# EAGLE design boot (EAGLE 6.1)
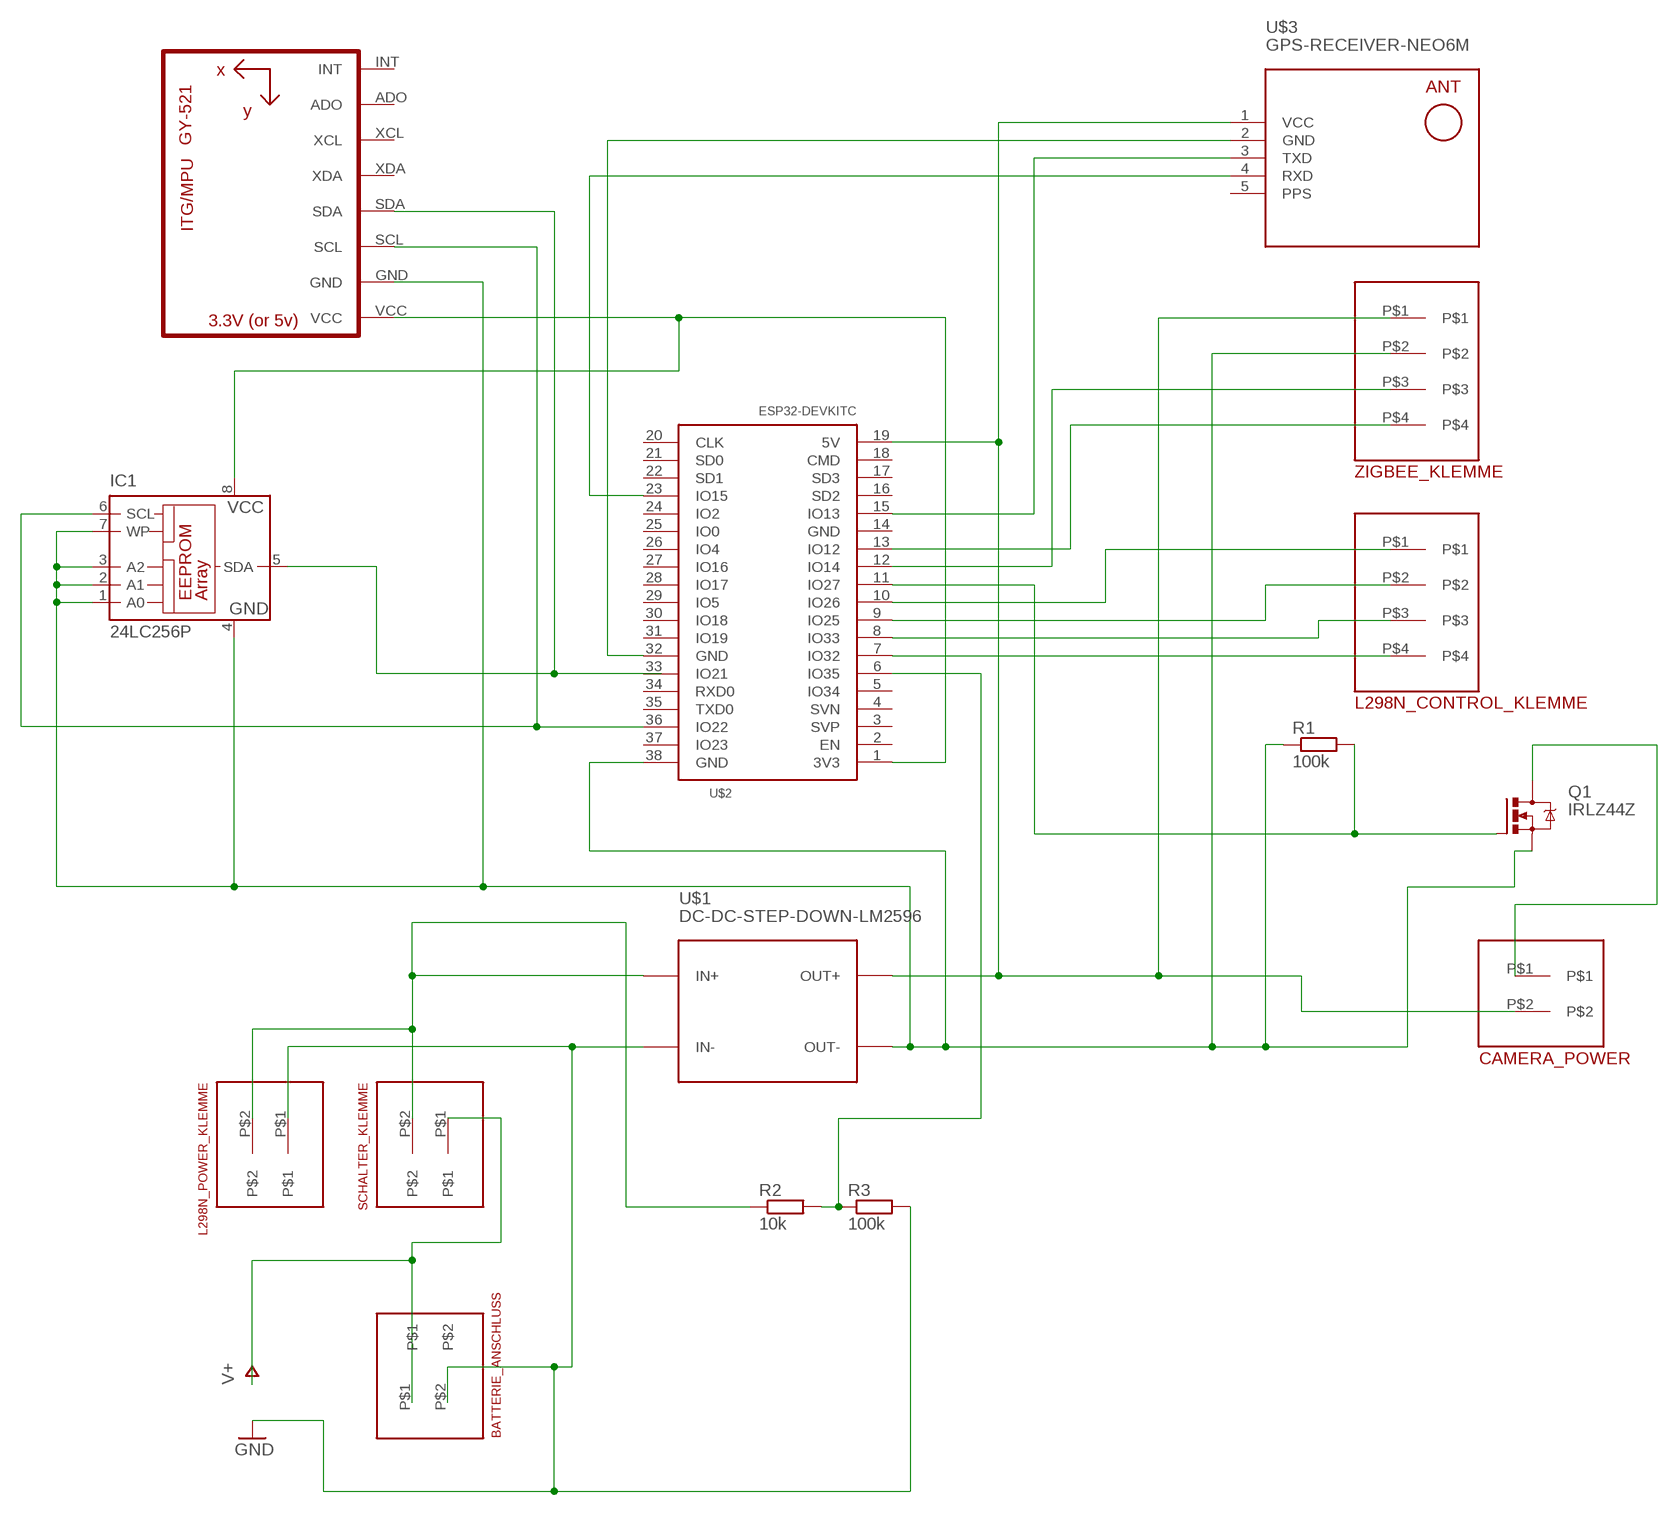
[diagram p0: schematic, sheet 1]

## Parts
BATTERIE_ANSCHLUSS  SCHRAUBKLEMME_X_2RM5.08  [2_PIN_RM5.08]
CAMERA_POWER  AKL_349_X2  [2_PIN_AKL_349_BUCHSE]
IC1  24LC256P  [DIL8]
L298N_CONTROL_KLEMME  SCHRAUBKLEMME_X_4  [4_PIN_RM5.08_SCHRAUBKLEMME]
L298N_POWER_KLEMME  SCHRAUBKLEMME_X_2RM5.08  [2_PIN_RM5.08]
Q1  IRLZ44Z  [TO220BH]
R1  100k  R-EU_0207/7  [0207/7]
R2  10k  R-EU_0207/7  [0207/7]
R3  100k  R-EU_0207/7  [0207/7]
SCHALTER_KLEMME  SCHRAUBKLEMME_X_2RM5.08  [2_PIN_RM5.08]
U1  GY-521MPU6050  [GY-521]
U$1  DC-DC-STEP-DOWN-LM2596  [DC-DC-STEP-DOWN-LM2596]
U$2  ESP32DEVKITC  [ESP32-DEVKITC]
U$3  GPS-RECEIVER-NEO6M  [GPS-RECEIVER-NEO6M]
ZIGBEE_KLEMME  SCHRAUBKLEMME_X_4  [4_PIN_RM5.08_SCHRAUBKLEMME]

## Nets
GND: BATTERIE_ANSCHLUSS.P$2 L298N_POWER_KLEMME.P$1 R3.2 U$1.IN-
N$1: CAMERA_POWER.P$2 U$1.OUT+ U$2.19(5V) U$3.1(VCC) ZIGBEE_KLEMME.P$1
N$2: IC1.1(A0) IC1.2(A1) IC1.3(A2) IC1.4(GND) IC1.7(WP) Q1.S R1.1 U1.GND U$1.OUT- U$2.38(GND) ZIGBEE_KLEMME.P$2
N$3: L298N_POWER_KLEMME.P$2 R2.1 SCHALTER_KLEMME.P$2 U$1.IN+
N$4: L298N_CONTROL_KLEMME.P$2 U$2.9(IO25)
N$5: L298N_CONTROL_KLEMME.P$3 U$2.8(IO33)
N$6: L298N_CONTROL_KLEMME.P$4 U$2.7(IO32)
N$7: L298N_CONTROL_KLEMME.P$1 U$2.10(IO26)
N$8: U$2.13(IO12) ZIGBEE_KLEMME.P$4
N$9: U$2.12(IO14) ZIGBEE_KLEMME.P$3
N$10: U$2.15(IO13) U$3.3(TXD)
N$11: U$2.32(GND) U$3.2(GND)
N$12: U$2.23(IO15) U$3.4(RXD)
N$13: IC1.8(VCC) U1.VCC U$2.1(3V3)
N$16: Q1.G R1.2 U$2.11(IO27)
N$18: R2.2 R3.1 U$2.6(IO35)
N$19: CAMERA_POWER.P$1 Q1.D
SCL: IC1.6(SCL) U1.SCL U$2.36(IO22)
SDA: IC1.5(SDA) U1.SDA
V+: BATTERIE_ANSCHLUSS.P$1 SCHALTER_KLEMME.P$1
Unconnected: U1.ADO U1.INT U1.XCL U1.XDA U$2.2(EN) U$2.3(SVP) U$2.4(SVN) U$2.5(IO34) U$2.14(GND) U$2.16(SD2) U$2.17(SD3) U$2.18(CMD) U$2.20(CLK) U$2.21(SD0) U$2.22(SD1) U$2.24(IO2) U$2.25(IO0) U$2.26(IO4) U$2.27(IO16) U$2.28(IO17) U$2.29(IO5) U$2.30(IO18) U$2.31(IO19) U$2.33(IO21) U$2.34(RXD0) U$2.35(TXD0) U$2.37(IO23)

## Power pins joined to a net without a drawn wire
PPS: U$3.5(PPS)

## Library data of the parts
BATTERIE_ANSCHLUSS L298N_POWER_KLEMME SCHALTER_KLEMME = eigene:SCHRAUBKLEMME_X_2
CAMERA_POWER = eigene:AKL_349_X2
IC1 = microchip:24*: Serial EEPROM I2C; MF: MICROCHIP; MPN: 24LC256-E/P; OC_FARNELL: 9757970; OC_NEWARK: 92C7169
L298N_CONTROL_KLEMME ZIGBEE_KLEMME = eigene:SCHRAUBKLEMME_X_4
Q1 = transistor-power:IRLZ44Z: N-Channel HEXFET® Power MOSFET Logic Level AUTOMOTIVE MOSFET Source: http://www.irf.com/product-info/datasheets/data/irlz44zpbf.pdf
R1-R3 = resistor:R-EU_: RESISTOR, European symbol
U1 = gy-521:GY-521
U$1 = lm2596_breakout:DC-DC-STEP-DOWN-LM2596: DC/DC Step-Down Regulator based on LM2596-ADJ chip LM2596 datasheet available here: http://www.ti.com/lit/ds/symlink/lm2596.pdf Click here to find device on ebay.com <http://www.ebay.com/sch/lm2596+power+regulator>
U$2 = ESP32-DEVKITC:ESP32DEVKITC
U$3 = diy-modules (1):GPS-RECEIVER-NEO6M: GPS Receiver Module based on NEO-6 device Short tutorial how to use NEO-6 module with Arduino: http://www.xarg.org/2016/06/neo6mv2-gps-module-with-arduino/ NEO-6 datasheet is available here: https://www.u-blox.com/sites/default/files/products/documents/NEO-6_DataSheet_%28GPS.G6-HW-09005%29.pdf Click here to find device on ebay.com <http://www.ebay.com/sch/gyneo6mv2>

## Board
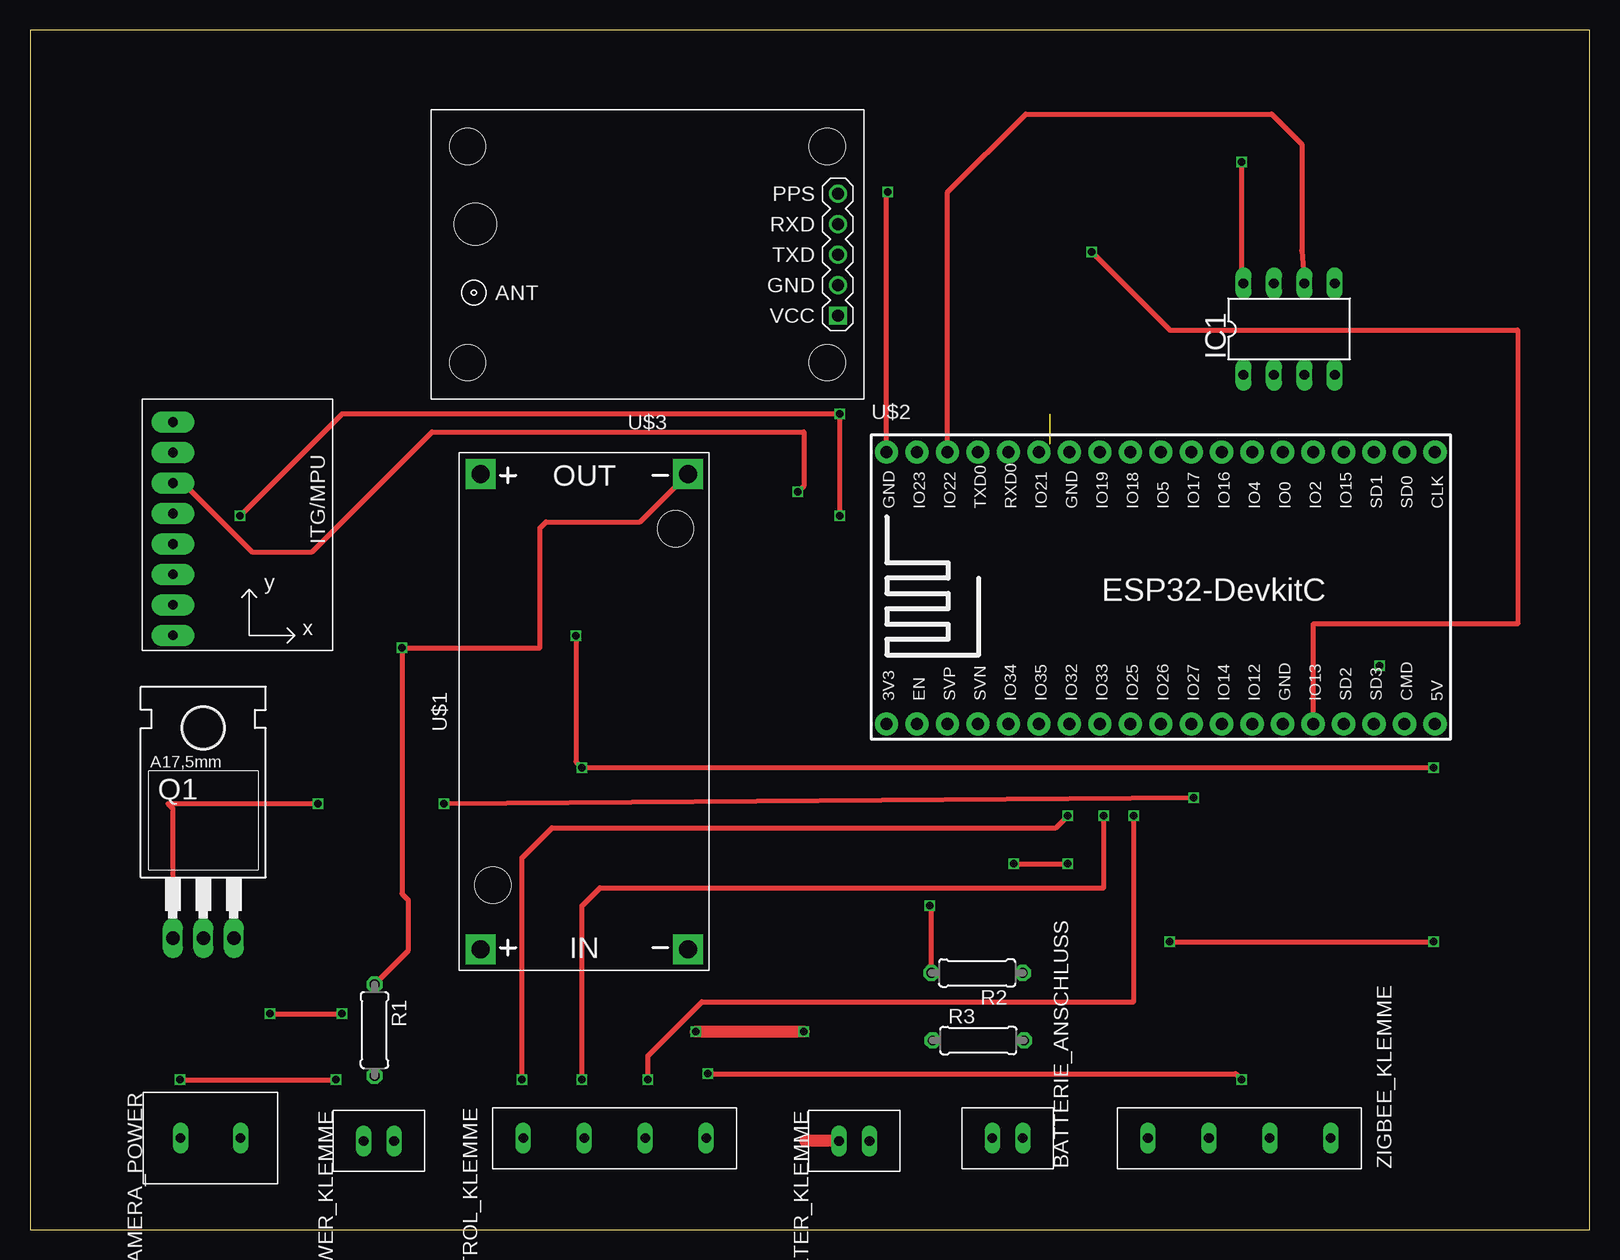
[diagram p1: board, top side]
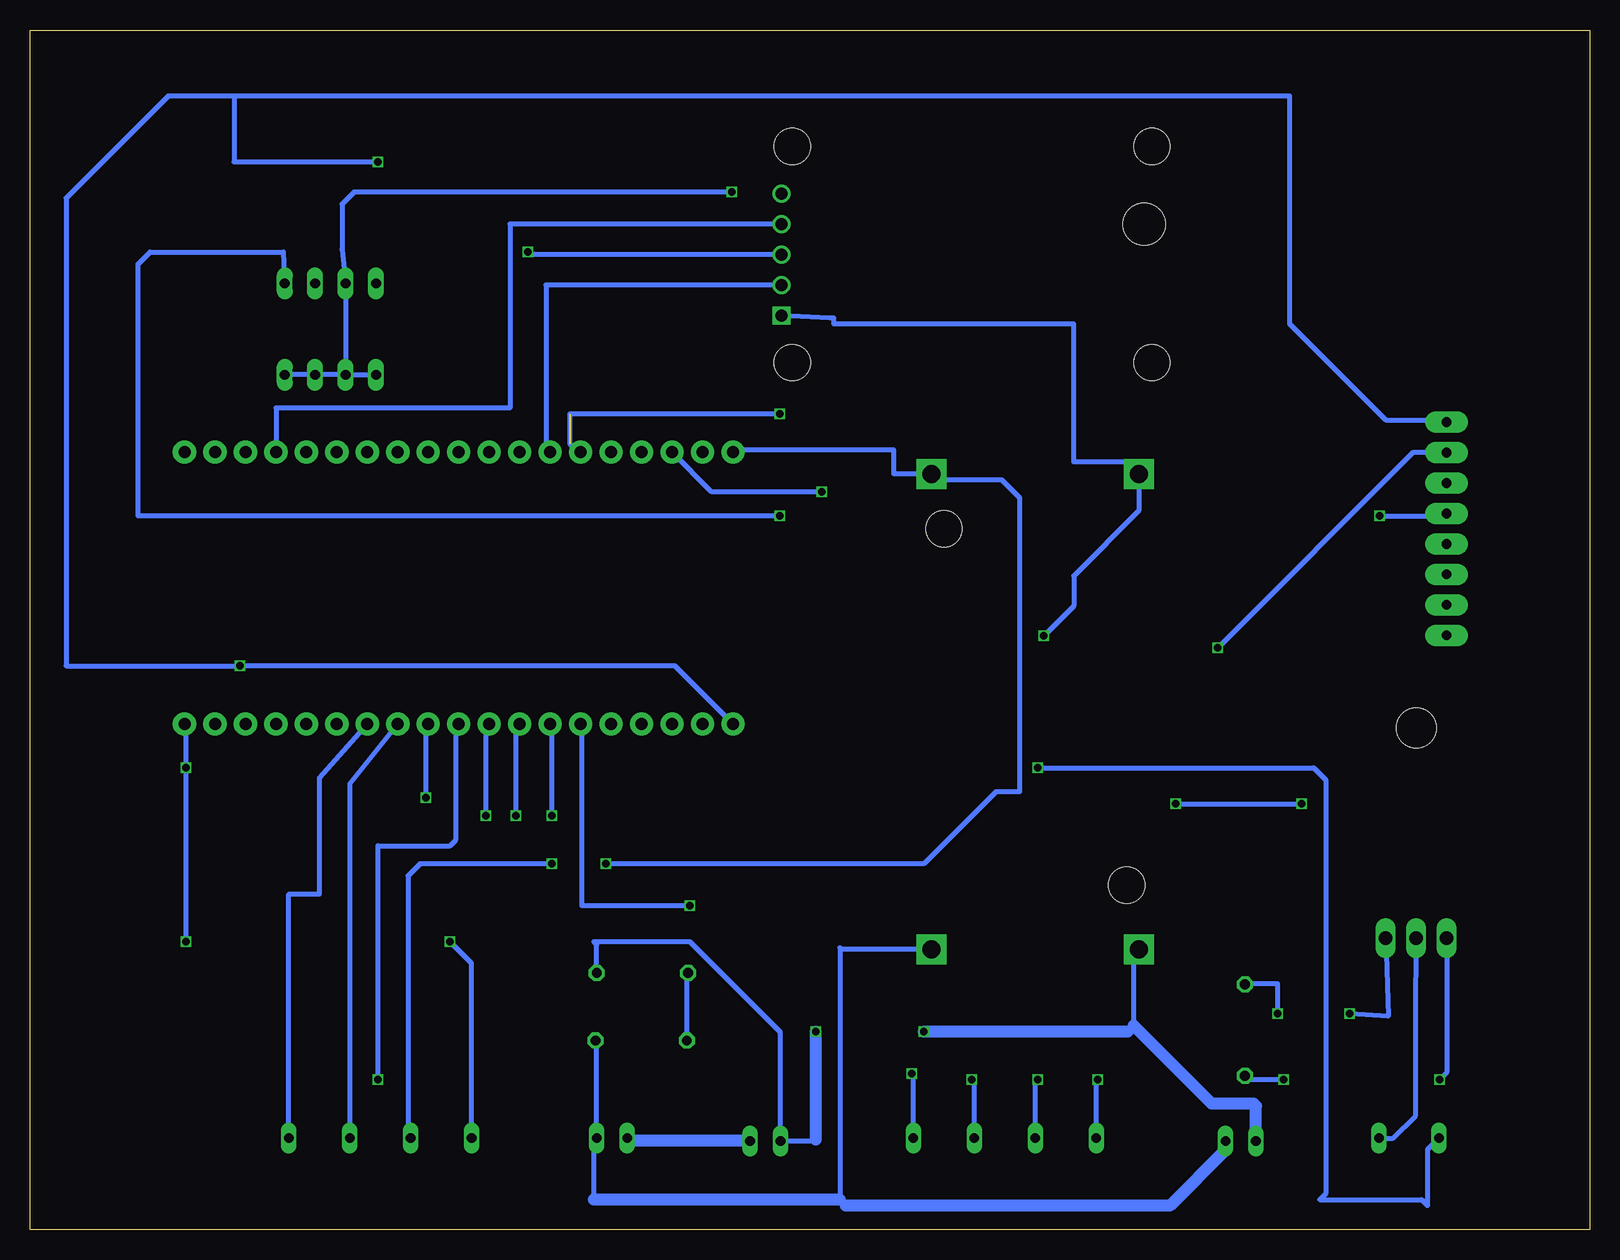
[diagram p2: board, bottom side, seen from below]

Size 130 x 100 mm. Coordinates in mm from the lower left corner, seen from the top.
Outline: 0,0 130,0 130,100 0,100 0,0
Copper layers (1*16): Top 0.035mm / dielectric 1.5mm / Bottom 0.035mm
Design rules: minimum track width 6mil, minimum drill 0.3mm, track to track 6mil, track to pad 6mil, pad to pad 6mil, via to via 6mil, smd to smd 0mil, copper to edge 10mil, drill to drill 10mil, minimum pad ring 10mil, minimum via ring 6mil, stop-mask expansion 2mil, vias tented up to drill 100mil, thermal gap 10mil

### Footprints (pad centres in the part's own frame; a part is rotated, then mirrored left to right if it is on the bottom)
2_PIN_RM5.08 = drill 0.8 long: P$1 0,1.27; P$2 0,-1.27
2_PIN_AKL_349_BUCHSE = drill 0.8 long: P$1 0,3.1; P$2 0,-1.9
DIL8 = drill 0.813 long: 1 -3.81,-3.81; 2 -1.27,-3.81; 3 1.27,-3.81; 4 3.81,-3.81; 5 3.81,3.81; 6 1.27,3.81; 7 -1.27,3.81; 8 -3.81,3.81
4_PIN_RM5.08_SCHRAUBKLEMME = drill 0.8 long: P$1 -2.54,10.16; P$2 -2.54,5.08; P$3 -2.54,0; P$4 -2.54,-5.08
TO220BH = drill 1.118 long: D 0,-6.35; G -2.54,-6.35; S 2.54,-6.35 | hole 3.302: 0,11.176
0207/7 = drill 0.813 octagon: 1 -3.81,0; 2 3.81,0
GY-521 = drill 0.8 pad 1.778 long: ADO -8.89,-6.35; GND -8.89,6.35; INT -8.89,-8.89; SCL -8.89,3.81; SDA -8.89,1.27; VCC -8.89,8.89; XCL -8.89,-3.81; XDA -8.89,-1.27
DC-DC-STEP-DOWN-LM2596 = drill 1.5 pad 2.5 square: IN+ -19.812,8.636; IN- -19.812,-8.636; OUT+ 19.812,8.636; OUT- 19.812,-8.636 | hole 3: -14.478,7.62; 15.24,-7.62
ESP32-DEVKITC = drill 1 pad 1.93: 1 -22.87,-11.42; 2 -20.33,-11.42; 3 -17.79,-11.42; 4 -15.25,-11.42; 5 -12.71,-11.42; 6 -10.17,-11.42; 7 -7.63,-11.42; 8 -5.09,-11.42; 9 -2.55,-11.42; 10 -0.01,-11.42; 11 2.53,-11.42; 12 5.07,-11.42; 13 7.61,-11.42; 14 10.15,-11.42; 15 12.69,-11.42; 16 15.23,-11.42; 17 17.77,-11.42; 18 20.31,-11.42; 19 22.85,-11.42; 20 22.85,11.23; 21 20.31,11.23; 22 17.77,11.23; 23 15.23,11.23; 24 12.69,11.23; 25 10.15,11.23; 26 7.61,11.23; 27 5.07,11.23; 28 2.53,11.23; 29 -0.01,11.23; 30 -2.55,11.23; 31 -5.09,11.23; 32 -7.63,11.23; 33 -10.17,11.23; 34 -12.71,11.23; 35 -15.25,11.23; 36 -17.79,11.23; 37 -20.33,11.23; 38 -22.87,11.23
GPS-RECEIVER-NEO6M = drill 1 square: 1 -15.875,5.08 | drill 1: 2 -15.875,2.54; 3 -15.875,0; 4 -15.875,-2.54; 5 -15.875,-5.08 | hole 3: -14.986,9.017; -14.986,-9.017; 14.986,-9.017; 14.986,9.017 | hole 3.5: 14.351,-2.54

### Placement (x,y rotation side)
BATTERIE_ANSCHLUSS  81.49,7.62 90 top
CAMERA_POWER  14.45,7.62 270 top
IC1  104.96,75.07 0 top
L298N_CONTROL_KLEMME  46.2,5.08 270 top
L298N_POWER_KLEMME  29.08,7.38 270 top
Q1  14.45,30.63 0 top
R1  28.72,16.62 270 top
R2  78.95,21.39 180 top
R3  79.05,15.76 0 top
SCHALTER_KLEMME  68.71,7.38 270 top
U1  20.8,58.42 0 top
U$1  46.2,43.18 90 top
U$2  94.27,53.57 0 top
U$3  51.47,81.28 180 top
ZIGBEE_KLEMME  103.35,10.16 90 top

### Tracks (layer width: path | path; a pad name or v marks a point on that pad's centre or on a via)
GND
  Bottom 0.406: R3.2 82.76,15.66 BATTERIE_ANSCHLUSS.P$2 83,7.38 83,2.5 | U$1.IN- 62.37,23.37 62.5,23.5 62.5,2.5 62,2 | L298N_POWER_KLEMME.P$1 30.35,6.65
  Bottom 1.016: 62.5,2.5 83,2.5 | 30.35,6.65 35,2 62,2
N$1  (via drill 0.6)
  Top 0.406: v45.5,49.5 45.5,39 v46,38.5 v117,38.5 | v95,24 v117,24
  Bottom 0.406: v45.5,49.5 43,52 43,54.5 37.56,59.94 U$1.OUT+ 37.5,62.99 38.51,64 43,64 43,75.5 63,75.5 63,76 63.34,76 U$3.1 | v46,38.5 23,38.5 22,37.5 22,3 22.5,2.5 14,2.5 13.5,2 13.5,6.67 CAMERA_POWER.P$2 | ZIGBEE_KLEMME.P$1 93.19,22.19 v95,24 | v117,24 v117,38.5 117,42.03 U$2.19
N$2  (via drill 0.6)
  Top 0.406: v20,18 v26,18 | v82,30.5 v86.5,30.5 | U$1.OUT- 50.84,59 43,59 42.5,58.5 42.5,48.5 v31,48.5 31,28 31.5,27.5 31.5,23.21 R1.1 | U$2.38 71.4,86.4 v71.5,86.5
  Bottom 0.406: U1.GND 14.73,64.77 v31,48.5 | Q1.S 16.78,17.78 v20,18 | v26,18 26,20.5 28.65,20.5 R1.1 | v82,30.5 55.5,30.5 49.5,36.5 47.5,36.5 47.5,61 49,62.5 54.34,62.5 U$1.OUT- 58,62.99 58,65 71.4,65 U$2.38 | v86.5,30.5 97.5,30.5 98.5,29.5 98.5,7.85 ZIGBEE_KLEMME.P$2 | v71.5,86.5 103,86.5 104,85.5 104,81.69 IC1.7 IC1.2 | IC1.2 IC1.1 | IC1.2 IC1.3 IC1.4
N$3  (via drill 0.6)
  Top 1.016: SCHALTER_KLEMME.P$2 64.62,7.38 | v64.5,16.5 v55.5,16.5
  Bottom 0.406: R2.1 82.76,23.76 83,24 75,24 67.44,16.44 SCHALTER_KLEMME.P$2 64.62,7.38 64.5,7.5 | 27.81,10.31 28,10.5 | U$1.IN+ 38,22.93 38,17 38.5,16.5
  Bottom 1.016: L298N_POWER_KLEMME.P$2 27.81,10.31 | 28,10.5 31.5,10.5 38,17 | 38.5,16.5 v55.5,16.5 | 64.5,7.5 v64.5,16.5
N$4  (via drill 0.6)
  Top 0.406: v51.5,12.5 51.5,14.5 56,19 92,19 v92,34.5
  Bottom 0.406: L298N_CONTROL_KLEMME.P$2 51.28,12.28 v51.5,12.5 | v92,34.5 92,41.87 U$2.9
N$5  (via drill 0.6)
  Top 0.406: v46,12.5 46,27 47.5,28.5 89.5,28.5 v89.5,34.5
  Bottom 0.406: L298N_CONTROL_KLEMME.P$3 46.2,12.3 v46,12.5 | v89.5,34.5 89.5,41.83 U$2.8
N$6  (via drill 0.6)
  Top 0.406: v41,12.5 41,31 43.5,33.5 85.5,33.5 v86.5,34.5
  Bottom 0.406: L298N_CONTROL_KLEMME.P$4 41.12,12.38 v41,12.5 | v86.5,34.5 86.5,42.01 U$2.7
N$7  (via drill 0.6)
  Top 0.406: v56.5,13 100.5,13 v101,12.5
  Bottom 0.406: L298N_CONTROL_KLEMME.P$1 56.36,12.86 v56.5,13 | v101,12.5 101,32 95,32 94.5,32.5 94.5,41.91 U$2.10
N$8
  Bottom 0.406: ZIGBEE_KLEMME.P$4 108.43,27.94 105.89,27.94 105.89,37.65 U$2.13
N$9
  Bottom 0.406: U$2.12 103.35,37.15 ZIGBEE_KLEMME.P$3
N$10  (via drill 0.6)
  Top 0.406: U$2.15 106.96,50.46 107,50.5 124,50.5 124,75 95,75 v88.5,81.5
  Bottom 0.406: U$3.3 88.5,81.28 v88.5,81.5
N$11
  Bottom 0.406: U$3.2 87,78.74 87,64.5 86.64,64.5 U$2.32
N$12
  Bottom 0.406: U$3.4 90,83.82 90,68.5 109.5,68.5 U$2.23
N$13  (via drill 0.6)
  Top 0.406: IC1.8 101,79.03 v101,89
  Bottom 0.406: U1.VCC 12.1,67.5 17,67.5 25,75.5 25,94.5 113,94.5 | 113,94.5 118.5,94.5 127,86 127,47 v112.5,47 112,47 76.25,47 U$2.1 | v101,89 113,89 113,94.5
N$16  (via drill 0.6)
  Top 0.406: v12.5,12.5 v25.5,12.5 | v97,36 v34.5,35.5 | v24,35.5 11.5,35.5 11.91,35.09 Q1.G
  Bottom 0.406: Q1.G 11.91,13.09 v12.5,12.5 | v25.5,12.5 28.41,12.5 R1.2 | v97,36 97,41.95 U$2.11 | v34.5,35.5 v24,35.5
N$18  (via drill 0.6)
  Top 0.406: R2.2 75.14,26.86 v75,27
  Bottom 0.406: R3.1 75.24,21.29 R2.2 | v75,27 84,27 84,42.05 U$2.6
N$19
  Bottom 0.406: CAMERA_POWER.P$1 16.38,7.62 14.5,9.5 14.5,17.73 Q1.D
SCL  (via drill 0.6)
  Top 0.406: U$2.36 76.48,86.48 83,93 103.5,93 106,90.5 106,81.61 IC1.6 | U1.SCL 12.77,62.23 18.5,56.5 23.5,56.5 33.5,66.5 64.5,66.5 64.5,62 v64,61.5
  Bottom 0.406: v64,61.5 73.18,61.5 U$2.36
SDA  (via drill 0.6)  (2 unrouted)
  Top 0.406: v17.5,59.5 26,68 v67.5,68 v67.5,59.5
  Bottom 0.406: v67.5,59.5 121,59.5 121,80.5 120,81.5 108.89,81.5 IC1.5 | v17.5,59.5 12.1,59.5 U1.SDA | 84,64.5 85,65.5 85,68 v67.5,68
V+
  Bottom 0.406: 79.98,7.38 BATTERIE_ANSCHLUSS.P$1
  Bottom 1.016: SCHALTER_KLEMME.P$1 79.98,7.38